# EAGLE design Level Shift Breakout (EAGLE 6.1)
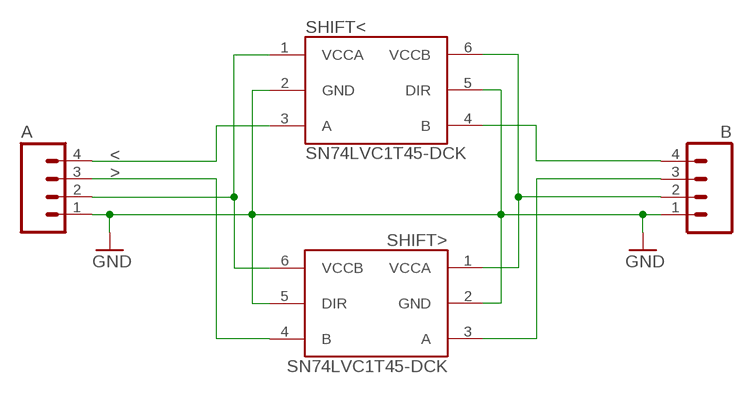
[diagram p0: schematic, sheet 1]

## Parts
A  M04PTH  [1X04]
B  M04PTH  [1X04]
SHIFT<  SN74LVC1T45-DCK  [SC70]
SHIFT>  SN74LVC1T45-DCK  [SC70]

## Nets
<: A.4 SHIFT<.3(A)
>: A.3 SHIFT>.4(B)
GND: A.1 B.1 SHIFT<.2(GND) SHIFT<.5(DIR) SHIFT>.2(GND) SHIFT>.5(DIR)
N$3: B.4 SHIFT<.4(B)
N$4: A.2 SHIFT<.1(VCCA) SHIFT>.6(VCCB)
N$5: B.2 SHIFT<.6(VCCB) SHIFT>.1(VCCA)
N$6: B.3 SHIFT>.3(A)

## Library data of the parts
A B = SparkFun:M04: Header 4 Standard 4-pin 0.1" header. Use with straight break away headers (SKU : PRT-00116), right angle break away headers (PRT-00553), swiss pins (PRT-00743), machine pins (PRT-00117), and female headers (PRT-00115). Molex polarized connector foot print use with SKU : PRT-08231 with associated crimp pins and housings. 1MM SMD Version SKU: PRT-10208
SHIFT< SHIFT> = OpenSpace:SN74LVC1T45

## Board
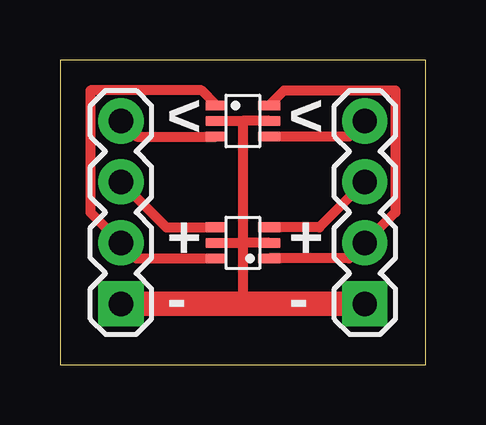
[diagram p1: board, top side]
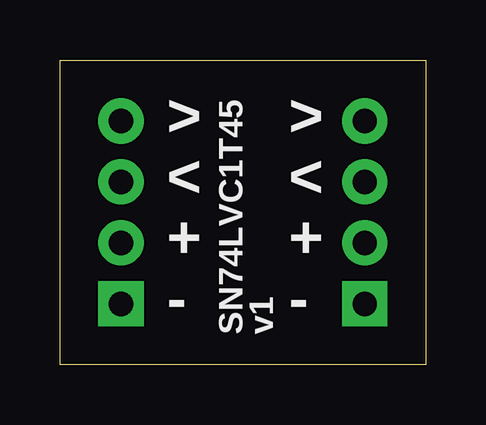
[diagram p2: board, bottom side, seen from below]

Size 15.24 x 12.7 mm. Coordinates in mm from the lower left corner, seen from the top.
Outline: 0,0 15.24,0 15.24,12.7 0,12.7 0,0
Copper layers (1*16): Top 0.035mm / dielectric 1.5mm / Bottom 0.035mm
Design rules: minimum track width 8mil, minimum drill 20mil, track to track 8mil, track to pad 8mil, pad to pad 8mil, via to via 8mil, smd to smd 8mil, copper to edge 10mil, drill to drill 8mil, minimum pad ring 12mil, minimum via ring 10mil, stop-mask expansion 4mil, vias tented up to drill 25mil, thermal gap 10mil

### Footprints (pad centres in the part's own frame; a part is rotated, then mirrored left to right if it is on the bottom)
1X04 = drill 1.016 pad 1.88 square: 1 0,0 | drill 1.016 pad 1.88: 2 2.54,0; 3 5.08,0; 4 7.62,0
SC70 = smd 0.4 x 0.9: 1 -0.65,-1.1; 2 0,-1.1; 3 0.65,-1.1; 4 0.65,1.1; 5 0,1.1; 6 -0.65,1.1

### Placement (x,y rotation side)
A  2.54,2.54 90 top
B  12.7,2.54 90 top
SHIFT<  7.62,10.16 270 top
SHIFT>  7.62,5.08 90 top

### Tracks (layer width: path | path; a pad name or v marks a point on that pad's centre or on a via)
<
  Top 0.406: A.4 3.19,9.51 SHIFT<.3
>
  Top 0.406: A.3 4.43,5.73 SHIFT>.4
GND
  Top 0.406: SHIFT<.2 7.62,10.16 | 7.62,10.16 7.62,5.08 | 7.62,5.08 7.62,2.54 | SHIFT<.5 7.62,10.16 | SHIFT>.2 7.62,5.08 | SHIFT>.5 7.62,5.08
  Top 1.016: A.1 7.62,2.54 B.1
N$3
  Top 0.406: B.4 12.05,9.51 SHIFT<.4
N$4
  Top 0.406: SHIFT>.6 3.19,4.43 A.2 1.27,6.35 1.27,11.43 5.9,11.43 SHIFT<.1
N$5
  Top 0.406: SHIFT>.1 12.05,4.43 B.2 13.97,6.35 13.97,11.43 9.34,11.43 SHIFT<.6
N$6
  Top 0.406: B.3 10.81,5.73 SHIFT>.3

### Text on the board
tPlace: < | < | + | + | - | -
bPlace: > | > | < | < | + | + | - | - | v1 | SN74LVC1T45